# Altium schematic sheet adc.SchDoc
size A4; Author: Omri Nissan; Organization: Altium Limited; Address1: -; Address2: San Luis Obispo; Address3: California, 93401; Address4: United States; DocumentNumber: 8; SheetNumber: 8; SheetTotal: 10
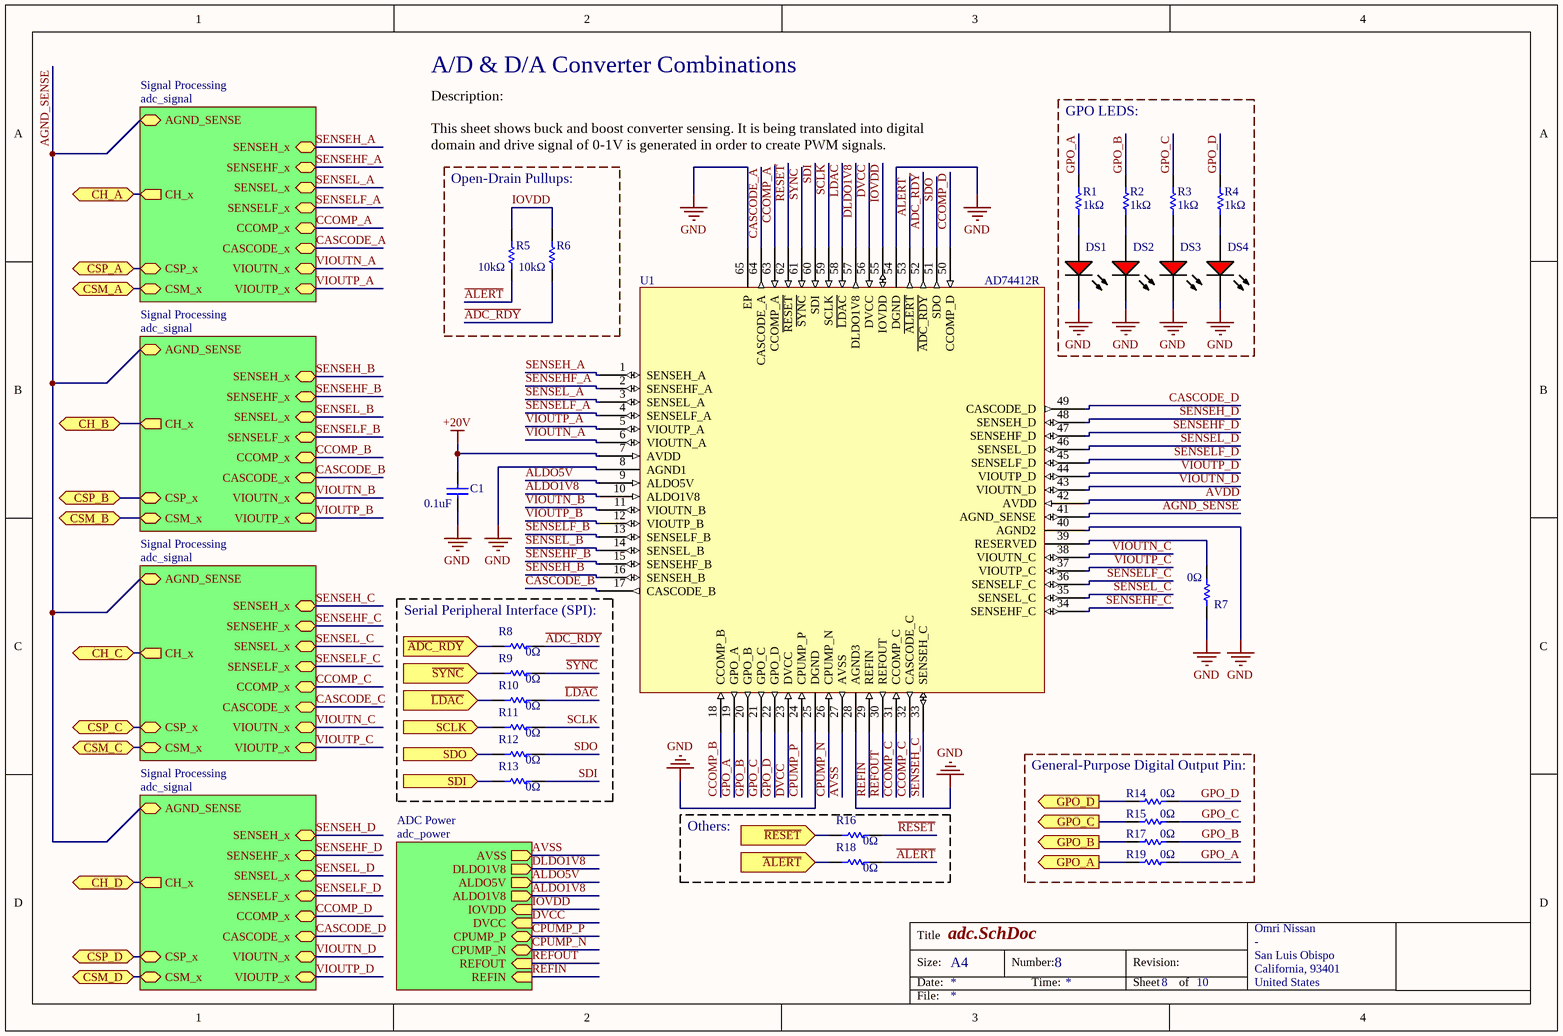
[diagram p0: adc.SchDoc]

## Parts
C1  0.1uF  [CAPC1608X90X35ML10T15]
DS1  HSMH-C150  [AVAG-HSMX-C150_V]  (value not drawn)
DS2  HSMH-C150  [AVAG-HSMX-C150_V]  (value not drawn)
DS3  HSMH-C150  [AVAG-HSMX-C150_V]  (value not drawn)
DS4  HSMH-C150  [AVAG-HSMX-C150_V]  (value not drawn)
R1  1kΩ  [RESC1608X55X30LL15T15]
R2  1kΩ  [RESC1608X55X30LL15T15]
R3  1kΩ  [RESC1608X55X30LL15T15]
R4  1kΩ  [RESC1608X55X30LL15T15]
R5  10kΩ  [RESC1609X55X30LL15T15]
R6  10kΩ  [RESC1609X55X30LL15T15]
R7  0Ω  [RESC1608X55X30LL20T20]
R8  0Ω  [RESC1608X55X30LL20T20]
R9  0Ω  [RESC1608X55X30LL20T20]
R10  0Ω  [RESC1608X55X30LL20T20]
R11  0Ω  [RESC1608X55X30LL20T20]
R12  0Ω  [RESC1608X55X30LL20T20]
R13  0Ω  [RESC1608X55X30LL20T20]
R14  0Ω  [RESC1608X55X30LL20T20]
R15  0Ω  [RESC1608X55X30LL20T20]
R16  0Ω  [RESC1608X55X30LL20T20]
R17  0Ω  [RESC1608X55X30LL20T20]
R18  0Ω  [RESC1608X55X30LL20T20]
R19  0Ω  [RESC1608X55X30LL20T20]
U1  AD74412R  [ADI-CP-64-4_L]

## Blocks framed on the sheet
GPO LEDS:: DS1-DS4 R1-R4
Open-Drain Pullups:: R5 R6
Serial Peripheral Interface (SPI):: R8-R13
General-Purpose Digital Output Pin:: R14 R15 R17 R19
Others:: R16 R18

## Sub-sheets
ADC Power = adc_power: AVSS (out), DLDO1V8 (out), ALDO5V (out), ALDO1V8 (out), IOVDD (in), CPUMP_P (bidir), REFOUT (in), REFIN (in), CPUMP_N (bidir), DVCC (in)
Signal Processing = adc_signal: AGND_SENSE (bidir), VIOUTN_x (bidir), CCOMP_x (bidir), SENSEH_x (bidir), CASCODE_x (bidir), SENSELF_x (bidir), CH_x (out), CSP_x (bidir), SENSEL_x (bidir), VIOUTP_x (bidir), CSM_x (bidir), SENSEHF_x (bidir)
Signal Processing = adc_signal: AGND_SENSE (bidir), VIOUTN_x (bidir), CCOMP_x (bidir), SENSEH_x (bidir), CASCODE_x (bidir), SENSELF_x (bidir), CH_x (out), CSP_x (bidir), SENSEL_x (bidir), VIOUTP_x (bidir), CSM_x (bidir), SENSEHF_x (bidir)
Signal Processing = adc_signal: AGND_SENSE (bidir), VIOUTN_x (bidir), CCOMP_x (bidir), SENSEH_x (bidir), CASCODE_x (bidir), SENSELF_x (bidir), CH_x (out), CSP_x (bidir), SENSEL_x (bidir), VIOUTP_x (bidir), CSM_x (bidir), SENSEHF_x (bidir)
Signal Processing = adc_signal: AGND_SENSE (bidir), VIOUTN_x (bidir), CCOMP_x (bidir), SENSEH_x (bidir), CASCODE_x (bidir), SENSELF_x (bidir), CH_x (out), CSP_x (bidir), SENSEL_x (bidir), VIOUTP_x (bidir), CSM_x (bidir), SENSEHF_x (bidir)

## Ports
CH_A (bidir), CH_B (bidir), CH_C (bidir), CH_D (bidir), CSM_A (bidir), CSM_B (bidir), CSM_C (bidir), CSM_D (bidir), CSP_A (bidir), CSP_B (bidir), CSP_C (bidir), CSP_D (bidir), GPO_A (out), GPO_B (out), GPO_C (out), GPO_D (out), SCLK (in), SDI (in), SDO (in), ~{ADC_RDY} (in), ~{ALERT} (in), ~{LDAC} (in), ~{RESET} (in), ~{SYNC} (in)

## Nets
+20V: C1.2 U1.7(AVDD)
GND: C1.1 DS1.2(K) DS2.2(K) DS3.2(K) DS4.2(K) R7.1 U1.8(AGND1) U1.25(DGND) U1.28(AGND3) U1.40(AGND2) U1.54(DGND) U1.65(EP)
~{ADC_RDY}: R6.1 R8.1 U1.52(~{ADC_RDY})
~{ADC_RDY}: R8.2 ; port ~{ADC_RDY}  [a separate net that carries the same name]
~{ALERT}: R18.2 ; port ~{ALERT}
~{ALERT}: R5.1 R18.1 U1.53(~{ALERT})  [a separate net that carries the same name]
~{LDAC}: R10.2 ; port ~{LDAC}
~{LDAC}: R10.1 U1.58(~{LDAC})  [a separate net that carries the same name]
~{RESET}: R16.2 ; port ~{RESET}
~{RESET}: R16.1 U1.62(~{RESET})  [a separate net that carries the same name]
~{SYNC}: R9.2 ; port ~{SYNC}
~{SYNC}: R9.1 U1.61(~{SYNC})  [a separate net that carries the same name]
AGND_SENSE: U1.41(AGND_SENSE) ; sheet Signal Processing/AGND_SENSE, sheet Signal Processing/AGND_SENSE, sheet Signal Processing/AGND_SENSE, sheet Signal Processing/AGND_SENSE
ALDO1V8: U1.10(ALDO1V8) ; sheet ADC Power/ALDO1V8
ALDO5V: U1.9(ALDO5V) ; sheet ADC Power/ALDO5V
AVDD: U1.42(AVDD)
AVSS: U1.27(AVSS) ; sheet ADC Power/AVSS
CASCODE_A: U1.64(CASCODE_A) ; sheet Signal Processing/CASCODE_x
CASCODE_B: U1.17(CASCODE_B) ; sheet Signal Processing/CASCODE_x
CASCODE_C: sheet Signal Processing/CASCODE_x
CASCODE_D: U1.49(CASCODE_D) ; sheet Signal Processing/CASCODE_x
CCOMP_A: U1.63(CCOMP_A) ; sheet Signal Processing/CCOMP_x
CCOMP_B: U1.18(CCOMP_B) ; sheet Signal Processing/CCOMP_x
CCOMP_C: U1.31(CCOMP_C) U1.32(CASCODE_C) ; sheet Signal Processing/CCOMP_x
CCOMP_D: U1.50(CCOMP_D) ; sheet Signal Processing/CCOMP_x
CH_A: port CH_A, sheet Signal Processing/CH_x
CH_B: port CH_B, sheet Signal Processing/CH_x
CH_C: port CH_C, sheet Signal Processing/CH_x
CH_D: port CH_D, sheet Signal Processing/CH_x
CPUMP_N: U1.26(CPUMP_N) ; sheet ADC Power/CPUMP_N
CPUMP_P: U1.24(CPUMP_P) ; sheet ADC Power/CPUMP_P
CSM_A: port CSM_A, sheet Signal Processing/CSM_x
CSM_B: port CSM_B, sheet Signal Processing/CSM_x
CSM_C: port CSM_C, sheet Signal Processing/CSM_x
CSM_D: port CSM_D, sheet Signal Processing/CSM_x
CSP_A: port CSP_A, sheet Signal Processing/CSP_x
CSP_B: port CSP_B, sheet Signal Processing/CSP_x
CSP_C: port CSP_C, sheet Signal Processing/CSP_x
CSP_D: port CSP_D, sheet Signal Processing/CSP_x
DLDO1V8: U1.57(DLDO1V8) ; sheet ADC Power/DLDO1V8
DVCC: U1.23(DVCC) U1.56(DVCC) ; sheet ADC Power/DVCC
GPO_A: R19.2 ; port GPO_A
GPO_A: R1.1 R19.1 U1.19(GPO_A)  [a separate net that carries the same name]
GPO_B: R17.2 ; port GPO_B
GPO_B: R2.1 R17.1 U1.20(GPO_B)  [a separate net that carries the same name]
GPO_C: R15.2 ; port GPO_C
GPO_C: R3.1 R15.1 U1.21(GPO_C)  [a separate net that carries the same name]
GPO_D: R14.2 ; port GPO_D
GPO_D: R4.1 R14.1 U1.22(GPO_D)  [a separate net that carries the same name]
IOVDD: R5.2 R6.2 U1.55(IOVDD) ; sheet ADC Power/IOVDD
REFIN: U1.29(REFIN) ; sheet ADC Power/REFIN
REFOUT: U1.30(REFOUT) ; sheet ADC Power/REFOUT
SCLK: R11.2 ; port SCLK
SCLK: R11.1 U1.59(SCLK)  [a separate net that carries the same name]
SDI: R13.2 ; port SDI
SDI: R13.1 U1.60(SDI)  [a separate net that carries the same name]
SDO: R12.2 ; port SDO
SDO: R12.1 U1.51(SDO)  [a separate net that carries the same name]
SENSEH_A: U1.1(SENSEH_A) ; sheet Signal Processing/SENSEH_x
SENSEH_B: U1.16(SENSEH_B) ; sheet Signal Processing/SENSEH_x
SENSEH_C: U1.33(SENSEH_C) ; sheet Signal Processing/SENSEH_x
SENSEH_D: U1.48(SENSEH_D) ; sheet Signal Processing/SENSEH_x
SENSEHF_A: U1.2(SENSEHF_A) ; sheet Signal Processing/SENSEHF_x
SENSEHF_B: U1.15(SENSEHF_B) ; sheet Signal Processing/SENSEHF_x
SENSEHF_C: U1.34(SENSEHF_C) ; sheet Signal Processing/SENSEHF_x
SENSEHF_D: U1.47(SENSEHF_D) ; sheet Signal Processing/SENSEHF_x
SENSEL_A: U1.3(SENSEL_A) ; sheet Signal Processing/SENSEL_x
SENSEL_B: U1.14(SENSEL_B) ; sheet Signal Processing/SENSEL_x
SENSEL_C: U1.35(SENSEL_C) ; sheet Signal Processing/SENSEL_x
SENSEL_D: U1.46(SENSEL_D) ; sheet Signal Processing/SENSEL_x
SENSELF_A: U1.4(SENSELF_A) ; sheet Signal Processing/SENSELF_x
SENSELF_B: U1.13(SENSELF_B) ; sheet Signal Processing/SENSELF_x
SENSELF_C: U1.36(SENSELF_C) ; sheet Signal Processing/SENSELF_x
SENSELF_D: U1.45(SENSELF_D) ; sheet Signal Processing/SENSELF_x
VIOUTN_A: U1.6(VIOUTN_A) ; sheet Signal Processing/VIOUTN_x
VIOUTN_B: U1.11(VIOUTN_B) ; sheet Signal Processing/VIOUTN_x
VIOUTN_C: U1.38(VIOUTN_C) ; sheet Signal Processing/VIOUTN_x
VIOUTN_D: U1.43(VIOUTN_D) ; sheet Signal Processing/VIOUTN_x
VIOUTP_A: U1.5(VIOUTP_A) ; sheet Signal Processing/VIOUTP_x
VIOUTP_B: U1.12(VIOUTP_B) ; sheet Signal Processing/VIOUTP_x
VIOUTP_C: U1.37(VIOUTP_C) ; sheet Signal Processing/VIOUTP_x
VIOUTP_D: U1.44(VIOUTP_D) ; sheet Signal Processing/VIOUTP_x
NetDS1_1: DS1.1(A) R1.2
NetDS2_1: DS2.1(A) R2.2
NetDS3_1: DS3.1(A) R3.2
NetDS4_1: DS4.1(A) R4.2
NetR7_2: R7.2 U1.39(RESERVED)

## Notes on the sheet
- A/D & D/A Converter Combinations
- Description:
  This sheet shows buck and boost converter sensing. It is being translated into digital domain and drive signal of 0-1V is generated in order to create PWM signals.
- Title
- Size:
- Date:
- A4
- Number:
- Time:
- Revision:
- Sheet
- of
- File:

## Library data of the parts
C1 = CMP-2100-03643-1: GRM188R71H104KA93D - Chip Capacitor, 0.1 uF, +/- 10%, 50 V, -55 to 125 degC, 0603 (1608 Metric), RoHS, Tape and Reel; Manufacturer: Murata; Dielectric Material: Ceramic; Voltage Rating: 50V; Capacitance: 100nF; Dielectric: X7R; Insulation Resistance: 10GR; Case Code (Metric): 1608; Lead Free: LeadFree; Depth: 0.8mm; Number of Pins: 2; Radiation Hardening: No; Case/Package: 0603; Manufacturer URL: http://www.murata.com/; Packaging: TapeandReel; Length: 1.6mm; Contact Plating: Tin; Datasheet URL: http://psearch.en.murata.com/capacitor/product/GRM188R71H104KA93%23.pdf; Tolerance: 10%; Case Code (Imperial): 0603; Min Operating Temperature: -55degC; RoHSCompliant: true; Voltage: 50V; Termination: SMD/SMT; Mount: SurfaceMount; Material: Ceramic; Package Quantity: 1; Height: 0.8mm; Thickness: 0.035inch; REACH SVHC: NoSVHC; Max Operating Temperature: 125degC; Width: 0.8mm; Package Reference: 0603; Voltage Rating (DC): 50V; Datasheet Version: 42675.0; Package Description: 2-Pin Surface Mount Device, Body 1.6 x 0.8 mm
DS1-DS4 = CMP-2000-06426-1: LED Uni-Color Red, 65 mW, 25 mA, -40 to 85 degC, 2-Pin SMD, RoHS, Tape and Reel; Manufacturer: Avago; Product Height (mm): 1.1mm; Power Dissipation: 78W; Product Length (mm): 3.2mm; Forward Voltage: 2.6V; Luminous Intensity: 17mcd; DELETED: Compliant; Shape Type: Rectangular; Peak Wavelength: 660nm; Main Category: ChipLED; Dominant Wave Length: 639nm; Rad Hardened: No; Lens Type: ColorlessDiffused; Product Depth (mm): 1.6mm; Reverse Voltage: 5V; Forward Current: 25mA; Chip Material: GaAlAs; Test Current (It): 20mA; Viewing Angle: 170deg; Number of  Elements: 1; Type: Uni-Color; Package Reference: HSMX-C150; Package Description: 2-Pin Surface Mount Device, Body 3.2 x 1.6 mm; Operating Temp Range: -40Cto85C; Mounting: SurfaceMount; Emitting Color: Red; Pin Count: 2; Operating Temperature Classification: Industrial; Datasheet URL: http://media.digikey.com/pdf/Data%20Sheets/Avago%20PDFs/HSMz-Czzz.pdf; Package Type: ChipLed; Mounting Technology: SurfaceMount; High Brightness: No; Lens Dimensions: 2x1.6x0.6mm; Manufacturer URL: http://www.avagotech.com/; Lum Intensity: 17mcd; Datasheet Version: 03/2012; Packaging: TapeandReel
R1-R4 = CMP-2000-00180-1: ERJ-3EKF1001V; Manufacturer: Panasonic; Part Number: ERJ-3EKF1001V
R5 R6 = CMP-2000-07452-1: ERJ3EKF1002V - Chip Resistor, 10 KOhm, +/- 1%, 0.1 W, -55 to 155 degC, 0603 (1608 Metric), RoHS, Tape and Reel; Manufacturer: Panasonic; Voltage Rating: 75V; Case\/Package: 0603; Power Rating: 100mW; Resistance: 10KOhm; Temperature Coefficient: 100ppm\/degreesC; Number of Pins: 2; Package Reference: 603; Depth: 0.8mm; Mount: SurfaceMount; Package Description: 2-Pin Surface Mount Device, Body 1.6 x 0.85 mm; Datasheet Version: 02/2017; Length: 1.6mm; Lead Free: LeadFree; Height: 0.45mm; Number of Terminations: 2; Max Power Dissipation: 100mW; Min Operating Temperature: -55degC; Datasheet URL: https://industrial.panasonic.com/cdbs/www-data/pdf/RDA0000/AOA0000C304.pdf; Termination: SMD/SMT; Case Code (Metric): 1608; Case Code (Imperial): 0603; Tolerance: 1%; Max Operating Temperature: 155degC; RoHSCompliant: true; Voltage Rating (DC): 75V; Radiation Hardening: No; Packaging: TapeandReel; Composition: ThickFilm; Mounting Technology: SurfaceMount; Manufacturer URL: http://www.panasonic.com/; Width: 0.031inch; REACH SVHC: NoSVHC; Contact Plating: Tin; Military Standard: Not; Package Quantity: 1
R7-R19 = CMP-2000-00091-1: ERA3AEB561V; Manufacturer: Panasonic; Part Number: ERA3AEB561V
U1 = AD74412RBCPZ: Manufacturer 1: Analog Devices; Supplier 1: Digi-Key; Manufacturer Part Number 1: AD74412RBCPZ; Stock 1: 0; Pricing 1: 1=15.06000, 10=13.84000, 25=13.26640, 100=11.68870, 250=11.11504, 500=10.39796, 1000=9.53743 (USD); RoHS: No; Supplier Part Number 1: 505-AD74412RBCPZ-ND